# EAGLE design PinscapePico KL25Z Adapter - 74HC165 vsn (EAGLE 7.7.0)

## Sheet 1 of 6: Main
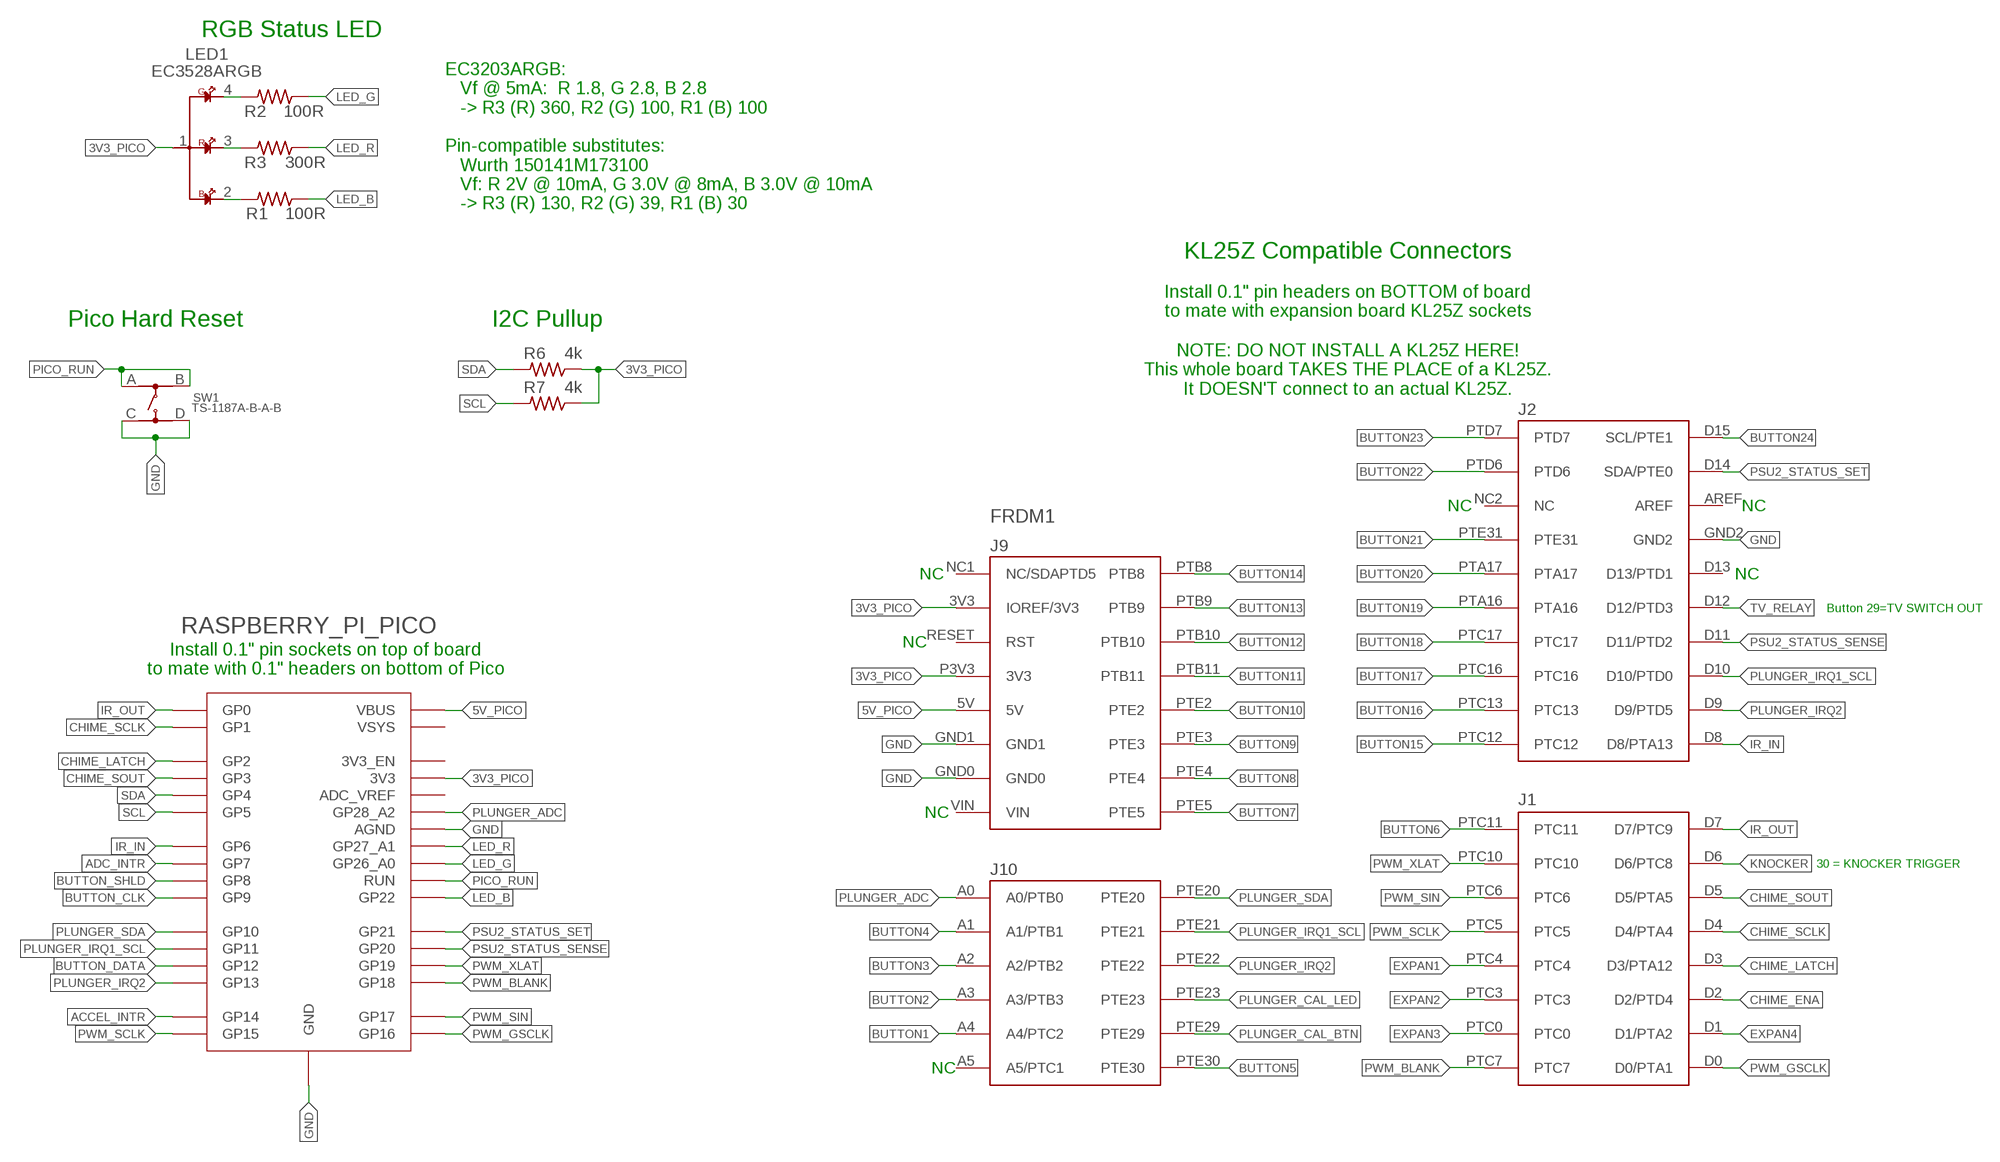
[diagram p0: schematic, sheet 1]

### Parts
FRDM1  KL25Z  FRDM-KL25ZNORMAL  [FRDM_KL25Z_NORMAL]
LED1  EC3528ARGB  [EC3528ARGB]
R1  100R  R-US_R1206  [R1206]
R2  100R  R-US_R1206  [R1206]
R3  300R  R-US_R1206  [R1206]
R6  4k  R-US_R1206  [R1206]
R7  4k  R-US_R1206  [R1206]
RASPBERRY_PI_PICO  RPI_PICO_NO_DEBUG  [RPI_PICO_TH_NO_DEBUG]
SW1  TS-1187A-B-A-B  [TS-1187A-B-A-B]

### Nets
3V3_PICO: FRDM1.3V3(IOREF/3V3) FRDM1.P3V3(3V3) LED1.1 R6.1 R7.1 RASPBERRY_PI_PICO.3V3 ; also sheet 2,3,4,5
5V_PICO: FRDM1.5V RASPBERRY_PI_PICO.VBUS
ACCEL_INTR: RASPBERRY_PI_PICO.GP14 ; also sheet 4
ADC_INTR: RASPBERRY_PI_PICO.GP7 ; also sheet 5
BUTTON1: FRDM1.A4(A4/PTC2) ; also sheet 2
BUTTON2: FRDM1.A3(A3/PTB3) ; also sheet 2
BUTTON3: FRDM1.A2(A2/PTB2) ; also sheet 2
BUTTON4: FRDM1.A1(A1/PTB1) ; also sheet 2
BUTTON5: FRDM1.PTE30 ; also sheet 2
BUTTON6: FRDM1.PTC11 ; also sheet 2
BUTTON7: FRDM1.PTE5 ; also sheet 2
BUTTON8: FRDM1.PTE4 ; also sheet 2
BUTTON9: FRDM1.PTE3 ; also sheet 2
BUTTON10: FRDM1.PTE2 ; also sheet 2
BUTTON11: FRDM1.PTB11 ; also sheet 2
BUTTON12: FRDM1.PTB10 ; also sheet 2
BUTTON13: FRDM1.PTB9 ; also sheet 2
BUTTON14: FRDM1.PTB8 ; also sheet 2
BUTTON15: FRDM1.PTC12 ; also sheet 2
BUTTON16: FRDM1.PTC13 ; also sheet 2
BUTTON17: FRDM1.PTC16 ; also sheet 2
BUTTON18: FRDM1.PTC17 ; also sheet 2
BUTTON19: FRDM1.PTA16 ; also sheet 2
BUTTON20: FRDM1.PTA17 ; also sheet 2
BUTTON21: FRDM1.PTE31 ; also sheet 2
BUTTON22: FRDM1.PTD6 ; also sheet 2
BUTTON23: FRDM1.PTD7 ; also sheet 2
BUTTON24: FRDM1.D15(SCL/PTE1) ; also sheet 2
BUTTON_CLK: RASPBERRY_PI_PICO.GP9 ; also sheet 2
BUTTON_DATA: RASPBERRY_PI_PICO.GP12 ; also sheet 2
BUTTON_SHLD: RASPBERRY_PI_PICO.GP8 ; also sheet 2
CHIME_ENA: FRDM1.D2(D2/PTD4) ; also sheet 3
CHIME_LATCH: FRDM1.D3(D3/PTA12) RASPBERRY_PI_PICO.GP2
CHIME_SCLK: FRDM1.D4(D4/PTA4) RASPBERRY_PI_PICO.GP1
CHIME_SOUT: FRDM1.D5(D5/PTA5) RASPBERRY_PI_PICO.GP3
EXPAN1: FRDM1.PTC4 ; also sheet 3
EXPAN2: FRDM1.PTC3 ; also sheet 3
EXPAN3: FRDM1.PTC0 ; also sheet 3
EXPAN4: FRDM1.D1(D1/PTA2) ; also sheet 3
GND: FRDM1.GND0 FRDM1.GND1 FRDM1.GND2 RASPBERRY_PI_PICO.AGND RASPBERRY_PI_PICO.GND@1(GND) RASPBERRY_PI_PICO.GND@2(GND) RASPBERRY_PI_PICO.GND@3(GND) RASPBERRY_PI_PICO.GND@4(GND) RASPBERRY_PI_PICO.GND@6(GND) RASPBERRY_PI_PICO.GND@7(GND) RASPBERRY_PI_PICO.GND@8(GND) SW1.C SW1.D ; also sheet 2,3,4,5
IR_IN: FRDM1.D8(D8/PTA13) RASPBERRY_PI_PICO.GP6
IR_OUT: FRDM1.D7(D7/PTC9) RASPBERRY_PI_PICO.GP0
KNOCKER: FRDM1.D6(D6/PTC8) ; also sheet 3
LED_B: R1.1 RASPBERRY_PI_PICO.GP22
LED_G: R2.1 RASPBERRY_PI_PICO.GP26_A0
LED_R: R3.1 RASPBERRY_PI_PICO.GP27_A1
N$8: LED1.3 R3.2
N$10: LED1.2 R1.2
N$13: LED1.4 R2.2
PICO_RUN: RASPBERRY_PI_PICO.RUN SW1.A SW1.B
PLUNGER_ADC: FRDM1.A0(A0/PTB0) RASPBERRY_PI_PICO.GP28_A2 ; also sheet 5
PLUNGER_CAL_BTN: FRDM1.PTE29 ; also sheet 3
PLUNGER_CAL_LED: FRDM1.PTE23 ; also sheet 3
PLUNGER_IRQ1_SCL: FRDM1.D10(D10/PTD0) FRDM1.PTE21 RASPBERRY_PI_PICO.GP11
PLUNGER_IRQ2: FRDM1.D9(D9/PTD5) FRDM1.PTE22 RASPBERRY_PI_PICO.GP13
PLUNGER_SDA: FRDM1.PTE20 RASPBERRY_PI_PICO.GP10
PSU2_STATUS_SENSE: FRDM1.D11(D11/PTD2) RASPBERRY_PI_PICO.GP20
PSU2_STATUS_SET: FRDM1.D14(SDA/PTE0) RASPBERRY_PI_PICO.GP21
PWM_BLANK: FRDM1.PTC7 RASPBERRY_PI_PICO.GP18
PWM_GSCLK: FRDM1.D0(D0/PTA1) RASPBERRY_PI_PICO.GP16
PWM_SCLK: FRDM1.PTC5 RASPBERRY_PI_PICO.GP15
PWM_SIN: FRDM1.PTC6 RASPBERRY_PI_PICO.GP17
PWM_XLAT: FRDM1.PTC10 RASPBERRY_PI_PICO.GP19
SCL: R7.2 RASPBERRY_PI_PICO.GP5 ; also sheet 3,4,5
SDA: R6.2 RASPBERRY_PI_PICO.GP4 ; also sheet 3,4,5
TV_RELAY: FRDM1.D12(D12/PTD3) ; also sheet 3
Unconnected: FRDM1.A5(A5/PTC1) FRDM1.AREF FRDM1.D13(D13/PTD1) FRDM1.NC1(NC/SDAPTD5) FRDM1.NC2(NC) FRDM1.RESET(RST) FRDM1.VIN RASPBERRY_PI_PICO.3V3_EN RASPBERRY_PI_PICO.ADC_VREF RASPBERRY_PI_PICO.VSYS

### Notes on the sheet
- RGB Status LED
- EC3203ARGB:
     Vf @ 5mA:  R 1.8, G 2.8, B 2.8
     -> R3 (R) 360, R2 (G) 100, R1 (B) 100
  
  Pin-compatible substitutes:
     Wurth 150141M173100
     Vf: R 2V @ 10mA, G 3.0V @ 8mA, B 3.0V @ 10mA
     -> R3 (R) 130, R2 (G) 39, R1 (B) 30
- KL25Z Compatible Connectors
- Install 0.1" pin headers on BOTTOM of board
  to mate with expansion board KL25Z sockets
- Pico Hard Reset | I2C Pullup
- NOTE: DO NOT INSTALL A KL25Z HERE!
  This whole board TAKES THE PLACE of a KL25Z.
  It DOESN'T connect to an actual KL25Z.
- NC | NC
- NC | NC
- Button 29=TV SWITCH OUT
- NC
- Install 0.1" pin sockets on top of board
  to mate with 0.1" headers on bottom of Pico
- NC
- 30 = KNOCKER TRIGGER
- NC

## Sheet 2 of 6: Buttons
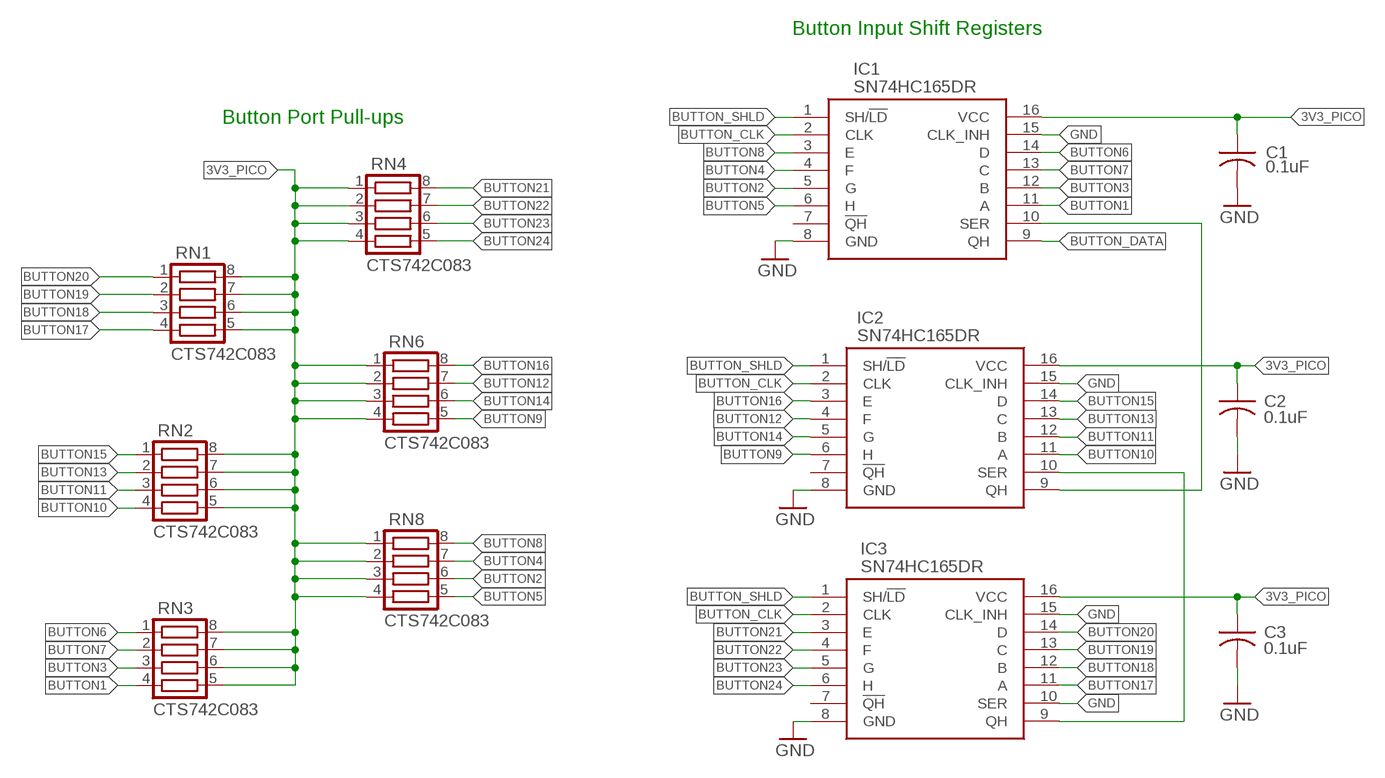
[diagram p1: schematic, sheet 2]

### Parts
C1  0.1uF  C-USC1206  [C1206]
C2  0.1uF  C-USC1206  [C1206]
C3  0.1uF  C-USC1206  [C1206]
IC1  SN74HC165DR  [SOIC127P600X175-16N]
IC2  SN74HC165DR  [SOIC127P600X175-16N]
IC3  SN74HC165DR  [SOIC127P600X175-16N]
RN1  CTS742C083  [CTS742C083]
RN2  CTS742C083  [CTS742C083]
RN3  CTS742C083  [CTS742C083]
RN4  CTS742C083  [CTS742C083]
RN6  CTS742C083  [CTS742C083]
RN8  CTS742C083  [CTS742C083]

### Nets
3V3_PICO: C1.1 C2.1 C3.1 IC1.16(VCC) IC2.16(VCC) IC3.16(VCC) RN1.5 RN1.6 RN1.7 RN1.8 RN2.5 RN2.6 RN2.7 RN2.8 RN3.5 RN3.6 RN3.7 RN3.8 RN4.1 RN4.2 RN4.3 RN4.4 RN6.1 RN6.2 RN6.3 RN6.4 RN8.1 RN8.2 RN8.3 RN8.4 ; also sheet 1,3,4,5
BUTTON1: IC1.11(A) RN3.4 ; also sheet 1
BUTTON2: IC1.5(G) RN8.6 ; also sheet 1
BUTTON3: IC1.12(B) RN3.3 ; also sheet 1
BUTTON4: IC1.4(F) RN8.7 ; also sheet 1
BUTTON5: IC1.6(H) RN8.5 ; also sheet 1
BUTTON6: IC1.14(D) RN3.1 ; also sheet 1
BUTTON7: IC1.13(C) RN3.2 ; also sheet 1
BUTTON8: IC1.3(E) RN8.8 ; also sheet 1
BUTTON9: IC2.6(H) RN6.5 ; also sheet 1
BUTTON10: IC2.11(A) RN2.4 ; also sheet 1
BUTTON11: IC2.12(B) RN2.3 ; also sheet 1
BUTTON12: IC2.4(F) RN6.7 ; also sheet 1
BUTTON13: IC2.13(C) RN2.2 ; also sheet 1
BUTTON14: IC2.5(G) RN6.6 ; also sheet 1
BUTTON15: IC2.14(D) RN2.1 ; also sheet 1
BUTTON16: IC2.3(E) RN6.8 ; also sheet 1
BUTTON17: IC3.11(A) RN1.4 ; also sheet 1
BUTTON18: IC3.12(B) RN1.3 ; also sheet 1
BUTTON19: IC3.13(C) RN1.2 ; also sheet 1
BUTTON20: IC3.14(D) RN1.1 ; also sheet 1
BUTTON21: IC3.3(E) RN4.8 ; also sheet 1
BUTTON22: IC3.4(F) RN4.7 ; also sheet 1
BUTTON23: IC3.5(G) RN4.6 ; also sheet 1
BUTTON24: IC3.6(H) RN4.5 ; also sheet 1
BUTTON_CLK: IC1.2(CLK) IC2.2(CLK) IC3.2(CLK) ; also sheet 1
BUTTON_DATA: IC1.9(QH) ; also sheet 1
BUTTON_SHLD: IC1.1(SH/!LD) IC2.1(SH/!LD) IC3.1(SH/!LD) ; also sheet 1
GND: C1.2 C2.2 C3.2 IC1.8(GND) IC1.15(CLK_INH) IC2.8(GND) IC2.15(CLK_INH) IC3.8(GND) IC3.10(SER) IC3.15(CLK_INH) ; also sheet 1,3,4,5
N$3: IC1.10(SER) IC2.9(QH)
N$4: IC2.10(SER) IC3.9(QH)
Unconnected: IC1.7(!QH) IC2.7(!QH) IC3.7(!QH)

### Notes on the sheet
- Button Input Shift Registers
- Button Port Pull-ups

## Sheet 3 of 6: GPIO Expander
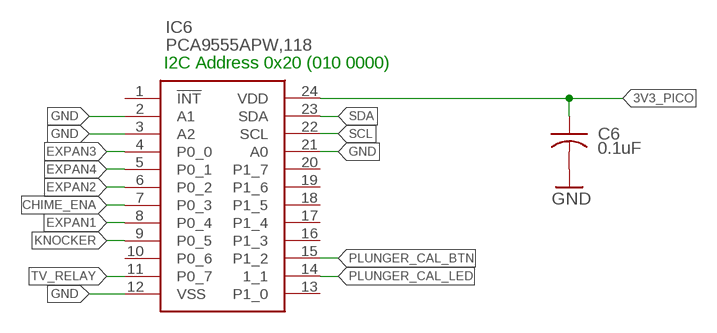
[diagram p2: schematic, sheet 3]

### Parts
C6  0.1uF  C-USC1206  [C1206]
IC6  PCA9555APW,118  [SOP65P640X110-24N]

### Nets
3V3_PICO: C6.1 IC6.24(VDD) ; also sheet 1,2,4,5
CHIME_ENA: IC6.7(P0_3) ; also sheet 1
EXPAN1: IC6.8(P0_4) ; also sheet 1
EXPAN2: IC6.6(P0_2) ; also sheet 1
EXPAN3: IC6.4(P0_0) ; also sheet 1
EXPAN4: IC6.5(P0_1) ; also sheet 1
GND: C6.2 IC6.2(A1) IC6.3(A2) IC6.12(VSS) IC6.21(A0) ; also sheet 1,2,4,5
KNOCKER: IC6.9(P0_5) ; also sheet 1
PLUNGER_CAL_BTN: IC6.15(P1_2) ; also sheet 1
PLUNGER_CAL_LED: IC6.14(1_1) ; also sheet 1
SCL: IC6.22(SCL) ; also sheet 1,4,5
SDA: IC6.23(SDA) ; also sheet 1,4,5
TV_RELAY: IC6.11(P0_7) ; also sheet 1
Unconnected: IC6.1(!INT) IC6.10(P0_6) IC6.13(P1_0) IC6.16(P1_3) IC6.17(P1_4) IC6.18(P1_5) IC6.19(P1_6) IC6.20(P1_7)

### Notes on the sheet
- I2C Address 0x20 (010 0000)

## Sheet 4 of 6: Accelerometer
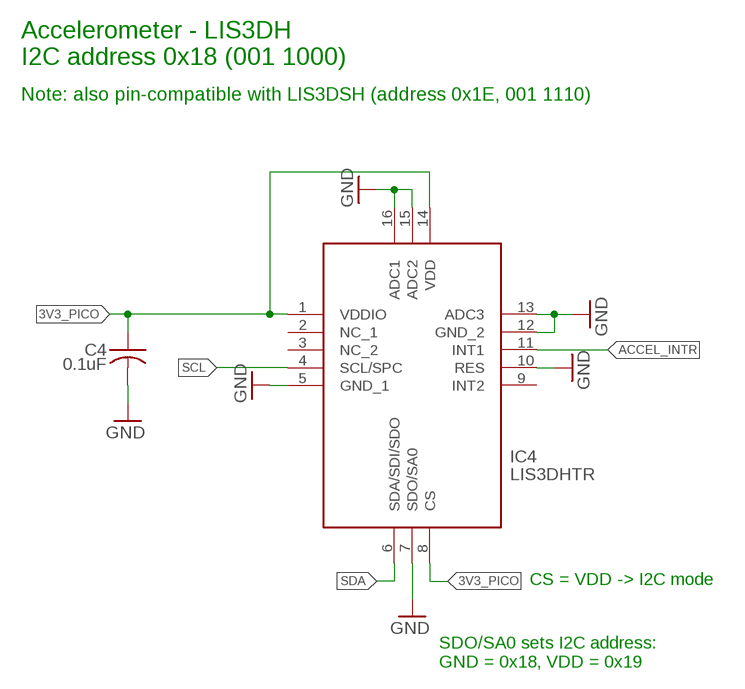
[diagram p3: schematic, sheet 4]

### Parts
C4  0.1uF  C-USC1206  [C1206]
IC4  LIS3DHTR  [LIS3DHTR]

### Nets
3V3_PICO: C4.1 IC4.1(VDDIO) IC4.8(CS) IC4.14(VDD) ; also sheet 1,2,3,5
ACCEL_INTR: IC4.11(INT1) ; also sheet 1
GND: C4.2 IC4.5(GND_1) IC4.7(SDO/SA0) IC4.10(RES) IC4.12(GND_2) IC4.13(ADC3) IC4.15(ADC2) IC4.16(ADC1) ; also sheet 1,2,3,5
SCL: IC4.4(SCL/SPC) ; also sheet 1,3,5
SDA: IC4.6(SDA/SDI/SDO) ; also sheet 1,3,5
Unconnected: IC4.2(NC_1) IC4.3(NC_2) IC4.9(INT2)

### Notes on the sheet
- Accelerometer - LIS3DH
  I2C address 0x18 (001 1000)
- Note: also pin-compatible with LIS3DSH (address 0x1E, 001 1110)
- CS = VDD -> I2C mode
- SDO/SA0 sets I2C address:
  GND = 0x18, VDD = 0x19

## Sheet 5 of 6: ADC
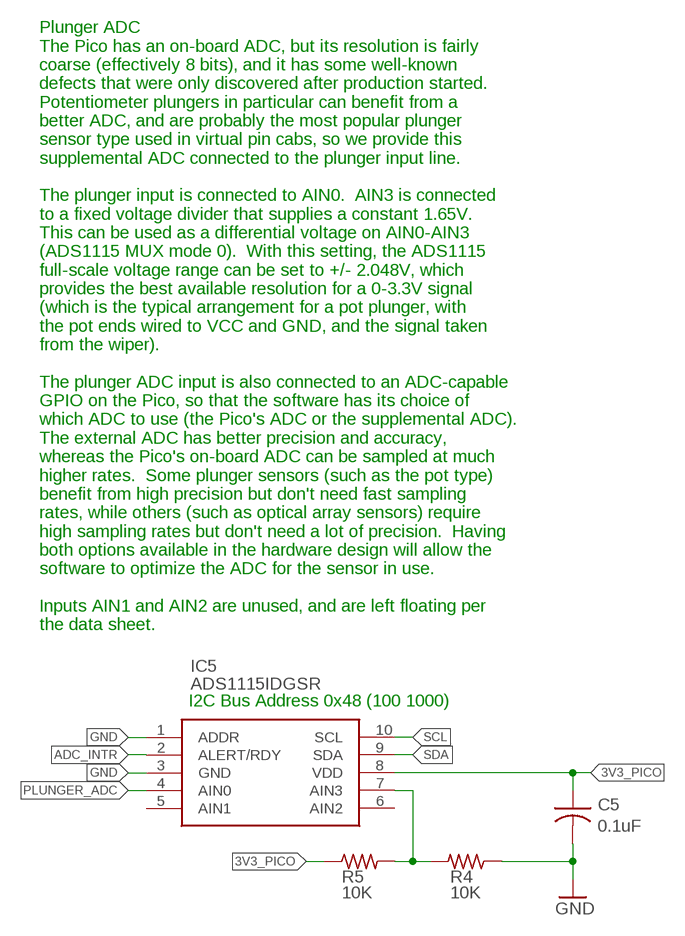
[diagram p4: schematic, sheet 5]

### Parts
C5  0.1uF  C-USC1206  [C1206]
IC5  ADS1115IDGSR  [SOP50P490X110-10N]
R4  10K  R-US_R1206  [R1206]
R5  10K  R-US_R1206  [R1206]

### Nets
3V3_PICO: C5.1 IC5.8(VDD) R5.1 ; also sheet 1,2,3,4
ADC_INTR: IC5.2(ALERT/RDY) ; also sheet 1
GND: C5.2 IC5.1(ADDR) IC5.3(GND) R4.1 ; also sheet 1,2,3,4
N$71: IC5.7(AIN3) R4.2 R5.2
PLUNGER_ADC: IC5.4(AIN0) ; also sheet 1
SCL: IC5.10(SCL) ; also sheet 1,3,4
SDA: IC5.9(SDA) ; also sheet 1,3,4
Unconnected: IC5.5(AIN1) IC5.6(AIN2)

### Notes on the sheet
- Plunger ADC
  The Pico has an on-board ADC, but its resolution is fairly
  coarse (effectively 8 bits), and it has some well-known
  defects that were only discovered after production started.
  Potentiometer plungers in particular can benefit from a
  better ADC, and are probably the most popular plunger
  sensor type used in virtual pin cabs, so we provide this
  supplemental ADC connected to the plunger input line.
  
  The plunger input is connected to AIN0.  AIN3 is connected
  to a fixed voltage divider that supplies a constant 1.65V.
  This can be used as a differential voltage on AIN0-AIN3
  (ADS1115 MUX mode 0).  With this setting, the ADS1115
  full-scale voltage range can be set to +/- 2.048V, which
  provides the best available resolution for a 0-3.3V signal
  (which is the typical arrangement for a pot plunger, with
  the pot ends wired to VCC and GND, and the signal taken
  from the wiper).
  
  The plunger ADC input is also connected to an ADC-capable
  GPIO on the Pico, so that the software has its choice of
  which ADC to use (the Pico's ADC or the supplemental ADC).
  The external ADC has better precision and accuracy,
  whereas the Pico's on-board ADC can be sampled at much
  higher rates.  Some plunger sensors (such as the pot type)
  benefit from high precision but don't need fast sampling
  rates, while others (such as optical array sensors) require
  high sampling rates but don't need a lot of precision.  Having
  both options available in the hardware design will allow the
  software to optimize the ADC for the sensor in use.
  
  Inputs AIN1 and AIN2 are unused, and are left floating per
  the data sheet.
- I2C Bus Address 0x48 (100 1000)

## Sheet 6 of 6: Notes
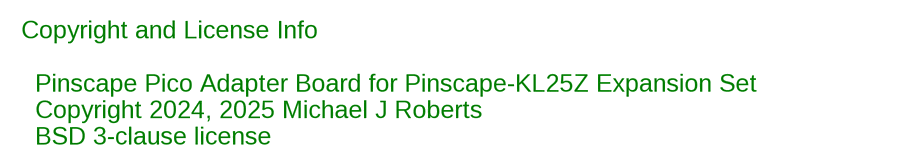
[diagram p5: schematic, sheet 6]

### Notes on the sheet
- Copyright and License Info
  
    Pinscape Pico Adapter Board for Pinscape-KL25Z Expansion Set
    Copyright 2024, 2025 Michael J Roberts
    BSD 3-clause license

## Library data of the parts
C1-C6 = rcl:C-US: CAPACITOR, American symbol; SPICEPREFIX: C
FRDM1 = kl25z:FRDM-KL25Z: For creating FRDM-KL25Z shields
IC1-IC3 = SamacSys_Parts:SN74HC165DR: 8-Bit Parallel-Load Shift Registers Source: Datasheet <http://www.ti.com/lit/ds/symlink/sn74hc165.pdf>; DESCRIPTION: 8-Bit Parallel-Load Shift Registers; HEIGHT: 1.75mm; MANUFACTURER_NAME: Texas Instruments; MANUFACTURER_PART_NUMBER: SN74HC165DR; MOUSER_PART_NUMBER: 595-SN74HC165DR; MOUSER_PRICE-STOCK: https://www.mouser.co.uk/ProductDetail/Texas-Instruments/SN74HC165DR?qs=vxEfx8VrU7AaZtng63yj8Q%3D%3D
IC4 = SamacSys_Parts:LIS3DHTR: Accelerometer 3-Axis 2g/16g 1.8V LGA16 STMicroelectronics LIS3DHTR Accelerometer IC, 3-axis, I2C, SPI 1.71 3.6 V, 16-Pin LGA Source: Datasheet <http://www.st.com/content/ccc/resource/technical/document/datasheet/3c/ae/50/85/d6/b1/46/fe/CD00274221.pdf/files/CD00274221.pdf/jcr:content/translations/en.CD00274221.pdf>; DESCRIPTION: Accelerometer 3-Axis 2g/16g 1.8V LGA16 STMicroelectronics LIS3DHTR Accelerometer IC, 3-axis, I2C, SPI 1.71 3.6 V, 16-Pin LGA; HEIGHT: 1mm; MANUFACTURER_NAME: STMicroelectronics; MANUFACTURER_PART_NUMBER: LIS3DHTR; MOUSER_PART_NUMBER: 511-LIS3DHTR; MOUSER_PRICE-STOCK: https://www.mouser.co.uk/ProductDetail/STMicroelectronics/LIS3DHTR?qs=6la6oa3D8xzhXYax3cEo4w%3D%3D
IC5 = SamacSys_Parts:ADS1115IDGSR: 16-Bit 860SPS 4-Ch Delta-Sigma ADC With PGA, Oscillator, Vref, Comparator, and I2C Source: Datasheet <http://www.ti.com/lit/gpn/ADS1115>; DESCRIPTION: 16-Bit 860SPS 4-Ch Delta-Sigma ADC With PGA, Oscillator, Vref, Comparator, and I2C; HEIGHT: 1.1mm; MANUFACTURER_NAME: Texas Instruments; MANUFACTURER_PART_NUMBER: ADS1115IDGSR; MOUSER_PART_NUMBER: 595-ADS1115IDGSR; MOUSER_PRICE-STOCK: https://www.mouser.co.uk/ProductDetail/Texas-Instruments/ADS1115IDGSR?qs=IK5e5L0zOXjKCJoVMhYO%2FQ%3D%3D
IC6 = SamacSys_Parts:PCA9555APW,118: NXP - PCA9555APW,118 - I/O EXPANDER, 16BIT, 400KHZ, TSSOP-24 Source: Datasheet <http://www.nxp.com/docs/en/data-sheet/PCA9555A.pdf>; DESCRIPTION: NXP - PCA9555APW,118 - I/O EXPANDER, 16BIT, 400KHZ, TSSOP-24; HEIGHT: 1.1mm; MANUFACTURER_NAME: NXP; MANUFACTURER_PART_NUMBER: PCA9555APW,118; MOUSER_PART_NUMBER: 771-PCA9555APW118; MOUSER_PRICE-STOCK: https://www.mouser.co.uk/ProductDetail/NXP-Semiconductors/PCA9555APW118?qs=5C9Q4QJFsuPmpoGpn%2FKoIQ%3D%3D
LED1 = SamacSys_Parts:EC3528ARGB: EC3528ARGB RGB LED, 5mA, common anode, SMD 3528 package; Dongguan Ousike Optoelectronics Technology Co., Ltd.
R1-R7 = resistor:R-US_: RESISTOR, American symbol
RASPBERRY_PI_PICO = RaspberryPi_Pico:RPI_PICO_NO_DEBUG
RN1-RN4 RN6 RN8 = resistor-net:CTS742C083: Chip Resistor Array 4 Single Resistor Source: http://www.ctscorp.com/components/Datasheets/CTSChipArrayDs.pdf; OC_FARNELL: unknown; OC_NEWARK: unknown
SW1 = SamacSys_Parts:TS-1187A-B-A-B

## Board
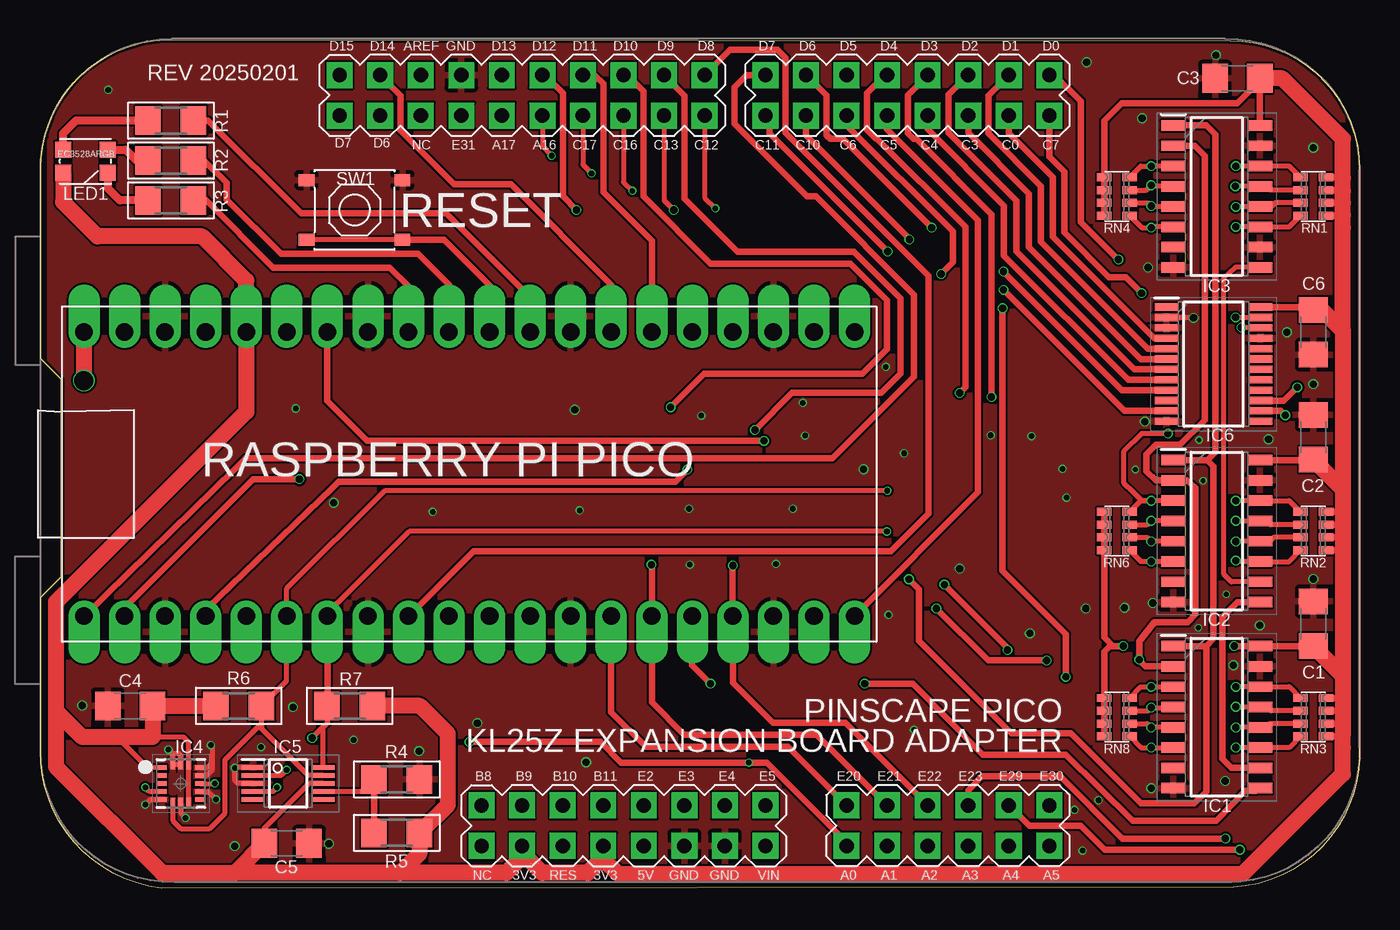
[diagram p6: board, top side]
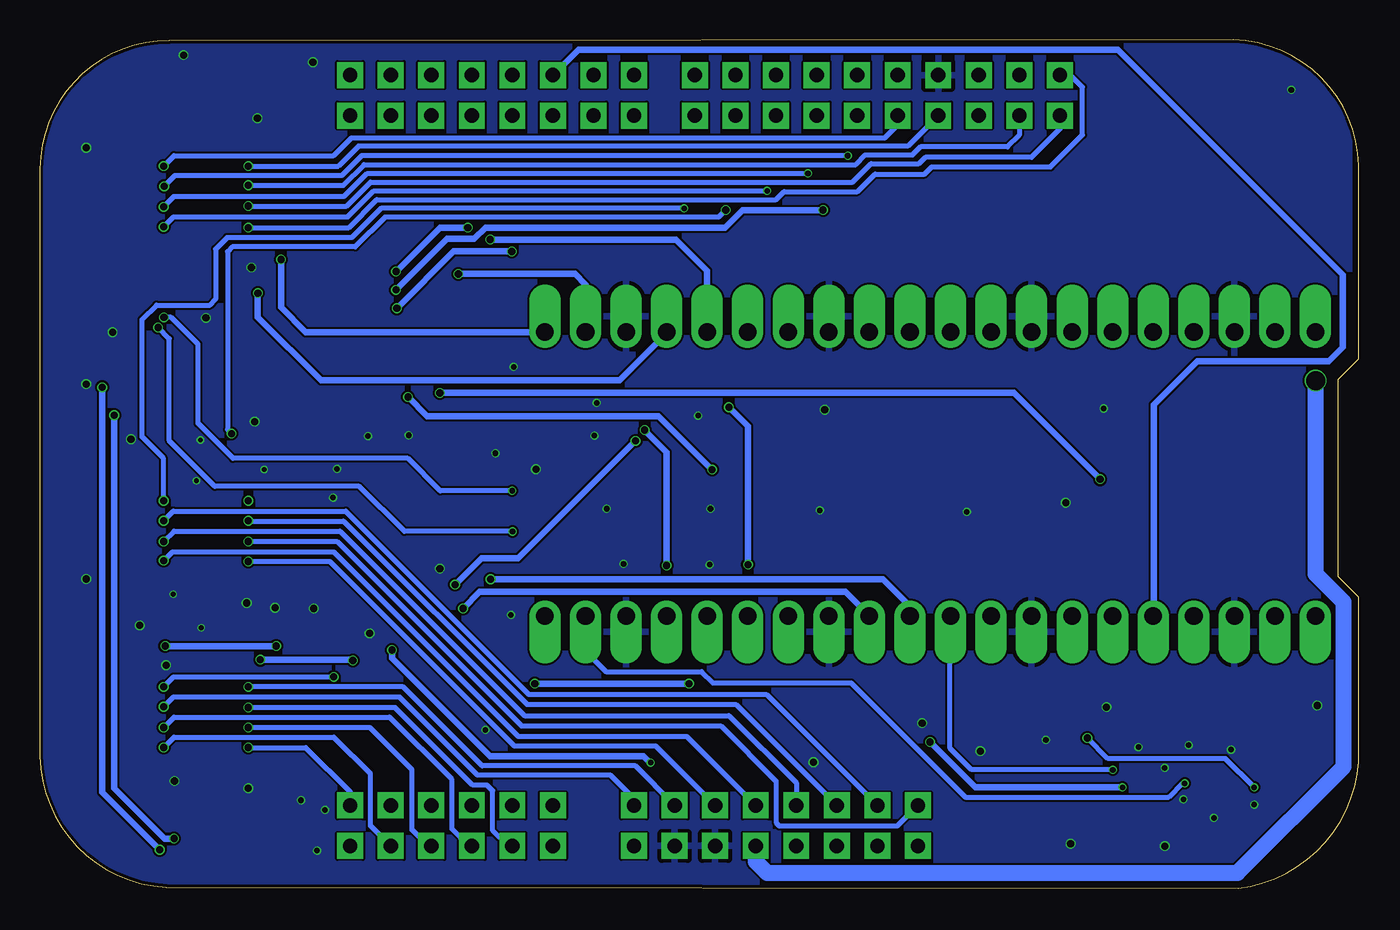
[diagram p7: board, bottom side, seen from below]

Size 82.6 x 53.1 mm. Coordinates in mm from the lower left corner, seen from the top.
Outline: 7.85,53.1 74.5,53.05 arc-90 82.6,45.05 82.6,8.25 arc-86 74.7,0.05 7.55,0 arc-79 0,7.9 0,18.2 1.3,19.5 1.3,31.85 0,33.15 0,45.25 arc-87 7.85,53.1
Copper layers (1*16): Top 0.035mm / dielectric 1.6mm / Bottom 0.035mm
Design rules "jlcpcb-2layers *": minimum track width 5mil, minimum drill 0.3mm, track to track 5mil, track to pad 5mil, pad to pad 5mil, via to via 5mil, smd to smd 5mil, copper to edge 0.2mm, drill to drill 6mil, minimum pad ring 10mil, minimum via ring 3mil, stop-mask expansion 4mil, vias tented up to drill 0mil, thermal gap 10mil

### Footprints (pad centres in the part's own frame; a part is rotated, then mirrored left to right if it is on the bottom)
C1206 = smd 1.6 x 1.8: 1 -1.4,0; 2 1.4,0
FRDM_KL25Z_NORMAL = drill 0.9 square: 3V3 24.13,-15.24; 5V 24.13,-7.62; A0 24.13,5.08; A1 24.13,7.62; A2 24.13,10.16; A3 24.13,12.7; A4 24.13,15.24; A5 24.13,17.78; AREF -24.13,-21.59; D0 -24.13,17.78; D1 -24.13,15.24; D2 -24.13,12.7; D3 -24.13,10.16; D4 -24.13,7.62; D5 -24.13,5.08; D6 -24.13,2.54; D7 -24.13,0; D8 -24.13,-3.81; D9 -24.13,-6.35; D10 -24.13,-8.89; D11 -24.13,-11.43; D12 -24.13,-13.97; D13 -24.13,-16.51; D14 -24.13,-24.13; D15 -24.13,-26.67; GND0 24.13,-2.54; GND1 24.13,-5.08; GND2 -24.13,-19.05; NC1 24.13,-17.78; NC2 -21.59,-21.59; P3V3 24.13,-10.16; PTA16 -21.59,-13.97; PTA17 -21.59,-16.51; PTB8 21.59,-17.78; PTB9 21.59,-15.24; PTB10 21.59,-12.7; PTB11 21.59,-10.16; PTC0 -21.59,15.24; PTC3 -21.59,12.7; PTC4 -21.59,10.16; PTC5 -21.59,7.62; PTC6 -21.59,5.08; PTC7 -21.59,17.78; PTC10 -21.59,2.54; PTC11 -21.59,0; PTC12 -21.59,-3.81; PTC13 -21.59,-6.35; PTC16 -21.59,-8.89; PTC17 -21.59,-11.43; PTD6 -21.59,-24.13; PTD7 -21.59,-26.67; PTE2 21.59,-7.62; PTE3 21.59,-5.08; PTE4 21.59,-2.54; PTE5 21.59,0; PTE20 21.59,5.08; PTE21 21.59,7.62; PTE22 21.59,10.16; PTE23 21.59,12.7; PTE29 21.59,15.24; PTE30 21.59,17.78; PTE31 -21.59,-19.05; RESET 24.13,-12.7; VIN 24.13,0
SOIC127P600X175-16N = smd 1.525 x 0.65: 1 -2.712,4.445; 2 -2.712,3.175; 3 -2.712,1.905; 4 -2.712,0.635; 5 -2.712,-0.635; 6 -2.712,-1.905; 7 -2.712,-3.175; 8 -2.712,-4.445; 9 2.712,-4.445; 10 2.712,-3.175; 11 2.712,-1.905; 12 2.712,-0.635; 13 2.712,0.635; 14 2.712,1.905; 15 2.712,3.175; 16 2.712,4.445
LIS3DHTR = smd 0.6 x 0.3: 1 -1.2,1; 2 -1.2,0.5; 3 -1.2,0; 4 -1.2,-0.5; 5 -1.2,-1; 9 1.2,-1; 10 1.2,-0.5; 11 1.2,0; 12 1.2,0.5; 13 1.2,1 | smd 0.3 x 0.6: 6 -0.5,-1.2; 7 0,-1.2; 8 0.5,-1.2; 14 0.5,1.2; 15 0,1.2; 16 -0.5,1.2
SOP50P490X110-10N = smd 1.4 x 0.3: 1 -2.2,1; 2 -2.2,0.5; 3 -2.2,0; 4 -2.2,-0.5; 5 -2.2,-1; 6 2.2,-1; 7 2.2,-0.5; 8 2.2,0; 9 2.2,0.5; 10 2.2,1
SOP65P640X110-24N = smd 1.475 x 0.45: 1 -2.938,3.575; 2 -2.938,2.925; 3 -2.938,2.275; 4 -2.938,1.625; 5 -2.938,0.975; 6 -2.938,0.325; 7 -2.938,-0.325; 8 -2.938,-0.975; 9 -2.938,-1.625; 10 -2.938,-2.275; 11 -2.938,-2.925; 12 -2.938,-3.575; 13 2.938,-3.575; 14 2.938,-2.925; 15 2.938,-2.275; 16 2.938,-1.625; 17 2.938,-0.975; 18 2.938,-0.325; 19 2.938,0.325; 20 2.938,0.975; 21 2.938,1.625; 22 2.938,2.275; 23 2.938,2.925; 24 2.938,3.575
EC3528ARGB = smd 1 x 1: 1 -0.725,1.4; 2 0.725,1.4; 3 -0.725,-1.4; 4 0.725,-1.4
R1206 = smd 1.6 x 1.803: 1 -1.422,0; 2 1.422,0
RPI_PICO_TH_NO_DEBUG = drill 1.1 pad 1.6 offset: 3V3 8.89,13.97; 3V3_EN 8.89,16.51; ADC_VREF 8.89,11.43; AGND 8.89,6.35; GND@1 -8.89,19.05; GND@2 -8.89,6.35; GND@3 -8.89,-6.35; GND@4 -8.89,-19.05; GND@6 8.89,-19.05; GND@7 8.89,-6.35; GND@8 8.89,19.05; GP0 -8.89,24.13; GP1 -8.89,21.59; GP2 -8.89,16.51; GP3 -8.89,13.97; GP4 -8.89,11.43; GP5 -8.89,8.89; GP6 -8.89,3.81; GP7 -8.89,1.27; GP8 -8.89,-1.27; GP9 -8.89,-3.81; GP10 -8.89,-8.89; GP11 -8.89,-11.43; GP12 -8.89,-13.97; GP13 -8.89,-16.51; GP14 -8.89,-21.59; GP15 -8.89,-24.13; GP16 8.89,-24.13; GP17 8.89,-21.59; GP18 8.89,-16.51; GP19 8.89,-13.97; GP20 8.89,-11.43; GP21 8.89,-8.89; GP22 8.89,-3.81; GP26_A0 8.89,1.27; GP27_A1 8.89,3.81; GP28_A2 8.89,8.89; RUN 8.89,-1.27; VBUS 8.89,24.13; VSYS 8.89,21.59
CTS742C083 = smd 0.5 x 0.9: 1 -1.2,-0.8; 2 -0.4,-0.8; 3 0.4,-0.8; 4 1.2,-0.8; 5 1.2,0.8; 6 0.4,0.8; 7 -0.4,0.8; 8 -1.2,0.8
TS-1187A-B-A-B = smd 1 x 0.75: A -3,1.875; B 3,1.875; C -3,-1.875; D 3,-1.875

### Placement (x,y rotation side)
C1  79.7,16.55 90 top
C2  79.7,28.22 90 top
C3  74.95,50.7 180 top
C4  5.6,11.4 180 top
C5  15.4,2.8 0 top
C6  79.7,34.8 270 top
FRDM1  45.39,26.77 270 top
IC1  73.65,10.7 0 top
IC2  73.65,22.35 0 top
IC3  73.65,43.3 0 top
IC4  8.78,6.54 0 top
IC5  15.5,6.55 0 top
IC6  73.45,32.8 0 top
LED1  2.8,45.5 90 top
R1  8.15,48.05 180 top
R2  8.15,45.55 180 top
R3  8.15,43.05 180 top
R4  22.3,6.8 180 top
R5  22.3,3.45 180 top
R6  12.4,11.4 0 top
R7  19.35,11.4 180 top
RASPBERRY_PI_PICO  26.84,25.92 90 top
RN1  79.7,43.3 270 top
RN2  79.7,22.35 270 top
RN3  79.7,10.7 270 top
RN4  67.4,43.3 270 top
RN6  67.4,22.35 270 top
RN8  67.4,10.7 270 top
SW1  19.65,42.45 180 top

### Tracks (layer width: path | path; a pad name or v marks a point on that pad's centre or on a via)
3V3_PICO  (via drill 0.45)
  Top 0.3: IC4.8 IC4.14 9.28,9.12 8.95,9.45 7,9.45 | C6.1 79.68,36.22 79.3,36.38 | IC5.8 16.8,6.55 14,3.75 C5.1 | 4.8,9.45 6.71,7.54 IC4.1
  Top 0.4: v74.75,15.15 v74.76,15.15 IC1.16 C1.1 | IC6.24 79.3,36.38 | 81.45,42.25 81.48,42.22 | 81.48,42.22 81.55,42.15 | 81.45,41.45 81.55,41.35 | 81.5,22.1 81.55,22.05 81.45,21.95 RN2.6 | 81.55,9.6 81.5,9.65 81.35,9.5 RN3.5 | RN8.4 RN8.3 RN8.2 RN8.1 66.6,14.8 66.95,15.15 v67.8,15.15 67.15,15.15 66.6,15.7 RN6.4 RN6.3 RN6.2 RN6.1 | RN4.4 RN4.3 RN4.2 RN4.1 66.6,48.05 67.7,49.15 74.96,49.15 76.35,50.54 C3.1 IC3.16 | IC2.16 79.68,26.8 C2.1 | RN2.8 81.55,23.55 | RN2.7 81.55,22.75 | RN2.5 81.45,21.15 81.55,21.25 | RN1.8 81.5,44.5 81.55,44.45 | RN1.7 81.5,43.7 81.55,43.65 | RN1.6 81.55,42.9 | RN1.5 81.35,42.1 81.48,42.22 | RN3.8 81.5,11.9 81.55,11.85 | RN3.7 81.5,11.1 81.55,11.05 | RN3.6 81.45,10.3 81.55,10.2
  Top 1: LED1.1 1.4,42.95 3.55,40.8 10.1,40.8 12.87,38.03 RASPBERRY_PI_PICO.3V3 12.87,29.82 0.95,17.9 0.95,11.1 | 81.55,34.9 81.55,25 | 81.55,25 81.55,23.55 81.55,22.75 81.55,22.05 81.55,21.25 81.55,13.3 | 81.55,34.9 81.55,41.35 81.55,42.15 81.55,42.9 81.55,43.65 81.55,44.45 81.55,46.9 77.75,50.7 C3.1 | 12.2,0.95 7.6,0.95 0.95,7.6 0.95,11.1 | 22.5,0.95 29.15,0.95 30.15,1.95 FRDM1.3V3 30.15,2.2 31.4,0.95 34.25,0.95 35.23,1.93 FRDM1.P3V3 35.23,1.82 36.15,0.9 75.3,0.9 81.55,7.15 81.55,8.8 81.55,9.6 81.55,10.2 81.55,11.05 81.55,11.85 81.55,13.3 | R6.1 C4.1 7,9.45 4.8,9.45 2.6,9.45 0.95,11.1 | C5.1 12.2,1 12.2,0.95 | C6.1 80.25,36.2 81.55,34.9 | 22.5,0.95 12.2,0.95 | 22.5,0.95 23.72,2.17 R5.1 25.5,5.23 25.5,9.65 23.75,11.4 R7.1 | C1.1 81.55,13.3 | C2.1 81.52,25 81.55,25
  Bottom 0.4: v74.75,15.15 v67.8,15.15
5V_PICO  (via drill 1.2)
  Top 1: v2.7,31.77 v2.71,31.78 RASPBERRY_PI_PICO.VBUS
  Bottom 1: FRDM1.5V 37.77,1.67 37.05,0.95 7.6,0.95 0.95,7.6 0.95,17.9 2.7,19.65 v2.7,31.77
ACCEL_INTR  (via drill 0.35)
  Top 0.3: IC4.11 10.79,6.54 v10.9,6.55
  Bottom 0.3: RASPBERRY_PI_PICO.GP14 48.43,14.83 47.15,13.55 41.15,13.55 40.45,12.85 31.8,12.85 24.65,5.7 11.9,5.7 11.05,6.55 v10.9,6.55
ADC_INTR  (via drill 0.35)
  Top 0.3: IC5.2 15.05,7.05 v15.4,7.4
  Bottom 0.3: v15.4,7.4 15.4,7.45 24.3,7.45 25.6,8.75 25.6,17 RASPBERRY_PI_PICO.GP7
BUTTON1  (via drill 0.45)
  Top 0.3: IC1.11 74.91,8.79 v74.85,8.8 | IC1.11 77.01,8.79 | RN3.4 78.2,8.79 IC1.11
  Bottom 0.3: v74.85,8.8 74.2,9.45 64.2,9.45 61.9,7.15 61.9,3.9 FRDM1.A4
BUTTON2  (via drill 0.45)
  Top 0.3: IC1.5 69.57,10.07 v69.55,10.05 69.3,10.3 RN8.6
  Bottom 0.3: FRDM1.A3 58.29,2.64 59.3,3.65 59.3,7.42 61.93,10.05 v69.55,10.05
BUTTON3  (via drill 0.45)
  Top 0.3: v74.85,10.05 74.87,10.07 IC1.12 76.75,10.07 76.98,10.3 RN3.3
  Bottom 0.3: FRDM1.A2 55.74,2.64 56.8,3.7 56.8,6.8 60.7,10.7 74.2,10.7 v74.85,10.05
BUTTON4  (via drill 0.45)
  Top 0.3: IC1.4 70.9,11.3 v69.55,11.3 69.35,11.1 RN8.7
  Bottom 0.3: FRDM1.A1 53.29,2.64 54.25,3.6 54.25,6.1 54.6,6.45 55.5,6.45 60.35,11.3 v69.55,11.3
BUTTON5  (via drill 0.45)
  Top 0.3: IC1.6 v69.55,8.8 v69.55,8.79 68.91,8.79 RN8.5
  Bottom 0.3: v69.55,8.8 65.95,8.8 63.17,6.02 FRDM1.PTE30
BUTTON6  (via drill 0.45)
  Top 0.3: v64.2,13.23 64.2,13.21 | IC1.14 v74.86,12.61 v74.85,12.6 | IC1.14 76.95,12.61 | IC1.14 78.2,12.61 RN3.1
  Top 0.4: v53.04,39.86 45.64,47.26 45.64,48.11 FRDM1.PTC11 | v60.24,36.3 60.24,19.86 64.2,15.9 v64.2,13.23
  Bottom 0.3: v74.85,12.6 74.23,13.23 v64.2,13.23
  Bottom 0.4: v53.04,39.86 56.69,39.86 v60.24,36.31 v60.24,36.3
BUTTON7  (via drill 0.45)
  Top 0.3: v74.85,11.35 74.87,11.34 IC1.13 76.82,11.34 77.05,11.1 RN3.2
  Bottom 0.3: FRDM1.PTE5 45.39,5.59 46.87,7.07 55.2,7.07 60.1,11.98 74.23,11.98 v74.85,11.35
BUTTON8  (via drill 0.45)
  Top 0.3: IC1.3 v69.56,12.61 v69.55,12.6 68.9,12.6 RN8.8
  Bottom 0.3: FRDM1.PTE4 42.85,5.2 45.3,7.65 54.9,7.65 59.85,12.6 v69.55,12.6
BUTTON9  (via drill 0.45)
  Top 0.3: IC2.6 v69.56,20.45 v69.55,20.45 68.9,20.45 RN6.5
  Bottom 0.3: v69.55,20.45 64.45,20.45 52.9,8.9 44.03,8.9 FRDM1.PTE3
BUTTON10  (via drill 0.45)
  Top 0.3: IC2.11 74.91,20.45 v74.85,20.5 | IC2.11 77.01,20.45 | IC2.11 78.2,20.45 RN2.4
  Bottom 0.3: v74.85,20.5 74.3,21.05 64.2,21.05 52.65,9.5 42.09,9.5 FRDM1.PTE2
BUTTON11  (via drill 0.45)
  Top 0.3: v74.85,21.7 74.87,21.71 IC2.12 76.98,21.71 77.22,21.95 RN2.3
  Bottom 0.3: v74.85,21.7 74.2,22.35 63.8,22.35 52.25,10.8 39.45,10.8 35.23,6.58 FRDM1.PTB11
BUTTON12  (via drill 0.45)
  Top 0.3: IC2.4 69.57,22.98 v69.55,23 69.3,22.75 RN6.7
  Bottom 0.3: v69.55,23 69.53,22.98 63.58,22.98 52.1,11.5 39.01,11.5 FRDM1.PTB10
BUTTON13  (via drill 0.45)
  Top 0.3: v74.85,23 76.35,23 IC2.13 76.77,22.98 77,22.75 RN2.2
  Bottom 0.3: v74.85,23 74.25,23.6 63.45,23.6 51.98,12.13 37.1,12.13 FRDM1.PTB9
BUTTON14  (via drill 0.45)
  Top 0.3: IC2.5 69.57,21.71 v69.55,21.7 69.3,21.95 RN6.6
  Bottom 0.3: v69.55,21.7 64,21.7 52.45,10.15 39.95,10.15 36.5,6.7 36.5,4.1 36.3,3.9 28.9,3.9 FRDM1.PTB8
BUTTON15  (via drill 0.35, 0.45)
  Top 0.3: FRDM1.PTC12 41.58,43.22 v42.25,42.55 | IC2.14 v74.86,24.25 v74.85,24.25 | IC2.14 77,24.25 | IC2.14 78.2,24.25 RN2.1
  Bottom 0.3: v42.25,42.55 61.25,42.55 63.07,40.72 70.88,40.72 71.6,40 71.6,36.85 71.95,36.5 75.3,36.5 76.2,35.6 76.2,28.25 74.85,26.9 v74.85,24.25
BUTTON16  (via drill 0.45)
  Top 0.3: FRDM1.PTC13 39.04,43.06 v39.65,42.45 | IC2.3 v69.56,24.25 | v69.56,24.25 68.96,24.25 68.14,25.07 68.13,25.07 67.85,25.35 67.85,27.35 68.95,28.45 v70.6,28.45 | v69.56,24.25 v69.55,24.25 68.9,24.25 RN6.8
  Bottom 0.3: v39.65,42.45 40.1,42 60.99,42 62.85,40.15 70.55,40.15 70.85,39.85 70.85,28.7 v70.6,28.45
BUTTON17  (via drill 0.35, 0.45)
  Top 0.3: IC3.11 v74.86,41.39 v74.85,41.4 | FRDM1.PTC16 36.5,44.2 v37.05,43.65 | IC3.11 77.01,41.39 | IC3.11 78.2,41.39 RN1.4
  Bottom 0.3: v74.85,41.4 74.25,42 63.35,42 61.7,43.65 v37.05,43.65
BUTTON18  (via drill 0.35, 0.45)
  Top 0.3: v74.85,42.65 74.98,42.66 IC3.12 76.41,42.61 77.04,42.61 77.32,42.9 RN1.3 | FRDM1.PTC17 33.96,45.29 v34.5,44.75
  Bottom 0.3: v74.85,42.65 74.2,43.3 63.55,43.3 62.1,44.75 v34.5,44.75
BUTTON19  (via drill 0.35, 0.45)
  Top 0.3: v74.82,43.93 IC3.13 76.77,43.93 77,43.7 RN1.2 | FRDM1.PTA16 31.42,46.43 v32,45.85
  Bottom 0.3: v74.82,43.93 74.15,44.6 63.7,44.6 62.45,45.85 v32,45.85
BUTTON20  (via drill 0.45)
  Top 0.3: IC3.14 v74.86,45.2 v74.85,45.2 | IC3.14 77,45.2 | RN1.1 78.2,45.2 IC3.14
  Bottom 0.3: v74.85,45.2 74.2,45.85 64.2,45.85 63.1,46.95 29.7,46.95 28.88,47.77 FRDM1.PTA17
BUTTON21  (via drill 0.45)
  Top 0.3: IC3.3 v69.56,45.2 v69.55,45.2 68.9,45.2 RN4.8
  Bottom 0.3: FRDM1.PTE31 28.25,46.45 62.65,46.45 63.9,45.2 v69.55,45.2
BUTTON22  (via drill 0.45)
  Top 0.3: IC3.4 69.62,43.93 v69.55,44 69.25,43.7 RN4.7
  Bottom 0.3: FRDM1.PTD6 21.26,47.14 22,46.4 27.45,46.4 27.95,45.9 30.9,45.9 31.5,45.3 62.3,45.3 63.6,44 v69.55,44
BUTTON23  (via drill 0.45)
  Top 0.3: IC3.5 69.59,42.66 v69.55,42.7 69.35,42.9 RN4.6
  Bottom 0.3: FRDM1.PTD7 18.72,47.53 20.5,45.75 27.15,45.75 27.55,45.35 30.55,45.35 31.7,44.2 61.9,44.2 63.4,42.7 v69.55,42.7
BUTTON24  (via drill 0.45)
  Top 0.3: IC3.6 69.59,41.39 v69.55,41.35 68.95,41.35 RN4.5
  Bottom 0.3: FRDM1.D15 18.05,50.9 17.3,50.15 17.3,47.15 19.3,45.15 26.75,45.15 27.2,44.7 30.3,44.7 31.4,43.6 36,43.6 36.5,43.1 61.5,43.1 63.25,41.35 v69.55,41.35
BUTTON_CLK  (via drill 0.45)
  Top 0.4: IC3.2 72.28,46.47 72.9,45.85 72.9,29.3 71.35,27.75 69.85,27.75 69.25,27.15 69.25,26.1 69.83,25.53 IC2.2 71.78,25.53 72.3,25.05 72.3,17.15 71.85,16.65 69.75,16.65 68.8,15.45 v68.8,14.3 68.8,14.25 69.18,13.88 IC1.2 | v63,14.25 59.35,14.25 v56.1,17.5
  Bottom 0.4: RASPBERRY_PI_PICO.GP9 30.65,17.05 32.15,18.55 55.05,18.55 v56.1,17.5 | v68.8,14.3 63.05,14.3 v63,14.25
BUTTON_DATA  (via drill 0.45)
  Top 0.4: RASPBERRY_PI_PICO.GP12 40.8,13.95 v41.95,12.8 | v51.6,12.8 54.61,12.8 59.01,8.35 64.2,8.35 68.4,4.2 73.6,4.2 73.65,4.25 75.45,6.1 76.1,6.1 76.26,6.25 IC1.9
  Bottom 0.4: v51.6,12.8 v41.95,12.8
BUTTON_SHLD  (via drill 0.45)
  Top 0.4: IC1.1 73,15.15 | 73,15.15 73.45,15.6 73.45,26.4 73.06,26.8 | IC2.1 73.06,26.8 | IC3.1 73.01,47.74 73.55,47.2 73.55,27.29 73.06,26.8 | 73,15.15 73,6.04 72.25,5.3 68.9,5.3 64.52,9.68 60.8,9.68 55,15.48 55,18.71 v54.38,19.34
  Bottom 0.4: RASPBERRY_PI_PICO.GP8 28.13,17.05 | v54.38,19.34 54.36,19.35 29.8,19.35 28.11,17.66 RASPBERRY_PI_PICO.GP8 | 28.11,17.36 RASPBERRY_PI_PICO.GP8
CHIME_ENA
  Top 0.4: FRDM1.D2 56.85,49.66 56.85,47.3 61.11,43.04 61.11,39.86 68.5,32.47 IC6.7
CHIME_LATCH  (via drill 0.45)
  Top 0.4: FRDM1.D3 54.3,49.65 54.3,47.25 54.65,46.9 54.85,46.9 59.55,42.2 v59.55,30.75 | RASPBERRY_PI_PICO.GP2 10.33,17.43 18.27,25.07 18.65,25.45 39.75,25.45 v40.5,26.2
  Bottom 0.4: 59.5,30.75 v59.55,30.75 58.35,29.55 43.85,29.55 v40.5,26.2
CHIME_SCLK  (via drill 0.45)
  Top 0.4: FRDM1.D4 52.9,50.9 51.75,49.75 51.75,47.49 52.29,46.95 52.35,46.95 57.9,41.4 57.9,31.35 v57.55,31 | v16.2,25.6 13.3,25.6 5.25,17.55 RASPBERRY_PI_PICO.GP1 5.25,17.15
  Bottom 0.4: v57.55,31 21.6,31 v16.2,25.6
CHIME_SOUT
  Bottom 0.4: FRDM1.D5 48.87,52.5 15.1,52.5 0.99,38.39 0.99,33.86 1.88,32.97 10.12,32.97 12.85,30.25 12.85,17.05 RASPBERRY_PI_PICO.GP3
EXPAN1
  Top 0.4: FRDM1.PTC4 55.55,47.5 60.34,42.71 60.34,39.59 68.11,31.82 IC6.8
EXPAN2
  Top 0.4: FRDM1.PTC3 58.09,47.28 61.89,43.48 61.89,40.13 68.9,33.12 IC6.6
EXPAN3
  Top 0.4: FRDM1.PTC0 60.63,47.26 63.38,44.51 63.38,40.78 69.74,34.42 IC6.4
EXPAN4
  Top 0.4: FRDM1.D1 59.35,49.62 59.35,47.25 62.65,43.95 62.65,40.46 69.34,33.77 IC6.5
GND  (via drill 0.3, 0.35, 0.45)
  Top 0.3: IC4.5 6.87,5.54 v6.55,5.22 | IC4.12 10.38,7.04 10.72,7.39 10.72,7.85 | v10.65,8.95 10.72,8.88 10.72,7.85 | IC4.7 8.78,4.7 v9.08,4.4 | IC4.10 10.48,6.04 v10.97,5.55 | IC6.2 72.18,35.72 v72.2,35.7 | IC5.3 12.35,6.55 12.15,6.75 v12.15,7.52 12.18,7.55 IC5.1 | IC4.13 10.42,7.54 10.72,7.85 | 8.23,8.45 8.28,8.4 IC4.16 IC4.15 8.78,8.28 8.6,8.45 8.23,8.45 | 8.23,8.45 v8,8.68
  other vias: 69.65,17.85 68.98,48.2 59.5,28.35 54.07,27.23 18.35,24.12 69.15,29.2 47.1,23.75 51.53,26.22 74.7,13.95 64.25,24.45 65.45,17.5 57.55,20 67.88,17.55 69.55,6.25 74.18,6.7 15.8,11.33 65.5,51.7 61.95,15.95 33.45,29.95 62.05,28.3 79.7,46.35 76.9,28.1 79.7,19.35 79.7,31.55 12.15,2.62 19.6,9.28 23.7,8.58 18.05,2.77 78.05,34.8 46.05,20.3 27.35,10.33 69.35,38.85 54.7,9.9 2.6,11.43 73.6,52.15 76.35,16.45 64,26.25 40.65,20.25 40.6,23.75 33.75,23.65 24.55,23.55 72.8,25.5 74.25,18.4 72.5,16.3 68.55,26.2 72.55,28.05 41.38,29.57 47.88,28.32 47.73,30.38 52.92,32.62 53.1,17.1 13.8,8.83 15.97,30.03 4.23,49.97 65.25,2.35 66.25,5.5 64.75,4.9 34.15,7.87
  pour Top: 0.6,53.5 82.3,53.5 82.3,0.2 0.6,0.2
  pour Bottom: 0.6,53.5 82.3,53.5 82.3,0.3 0.6,0.3
IR_IN
  Top 0.4: RASPBERRY_PI_PICO.GP6 27.1,21.1 53.25,21.1 55.6,23.45 55.6,38.35 46.65,47.3 46.65,52 46.15,52.5 43.18,52.5 FRDM1.D8
IR_OUT
  Top 0.4: RASPBERRY_PI_PICO.GP0 2.73,17.03 12.21,26.29 12.82,26.9 49.6,26.9 54.7,32 54.7,37.15 48.55,43.3 48,43.3 43.45,47.85 43.45,50.15 44.2,50.9 FRDM1.D7
KNOCKER  (via drill 0.45)
  Top 0.4: FRDM1.D6 49.2,49.63 49.2,47.15 49.45,46.9 50.25,46.9 v55.8,41.35 | v60.3,38.6 60.3,38.58 67.71,31.18 IC6.9
  Bottom 0.4: v60.3,38.6 57.55,41.35 v55.8,41.35
LED_B
  Top 0.4: R1.1 10.5,48.05 16.3,42.25 25.4,42.25 28.8,38.85
  Top 0.406: RASPBERRY_PI_PICO.GP22 30.65,37 28.8,38.85
LED_G
  Top 0.4: R2.1 10.25,45.55 11.65,44.15 11.65,43.1 15.05,39.7 23.65,39.7 25.57,37.78
  Top 0.406: RASPBERRY_PI_PICO.GP26_A0 25.57,37.78
LED_R
  Top 0.4: R3.1 10.35,43.05 14.55,38.85 21.85,38.85
  Top 0.406: RASPBERRY_PI_PICO.GP27_A1 23.03,37.67 21.85,38.85
N$3
  Top 0.4: IC1.10 74.58,7.52 74,8.1 74,16.95 74.96,17.91 IC2.9
N$4
  Top 0.3: IC2.10 74.58,19.18 74.1,19.65 74.1,38.2 74.81,38.85 IC3.9
N$8
  Top 0.5: LED1.3 4.2,43.8 4.95,43.05 R3.2
N$10
  Top 0.5: R1.2 2.2,48.05 1.4,47.25 LED1.2
N$13
  Top 0.5: LED1.4 5.33,46.22 6,45.55 R2.2
N$71
  Top 0.3: IC5.7 20.88,6.05
  Top 0.4: R4.2 20.88,6.05 R5.2
PICO_RUN
  Top 0.3: SW1.A SW1.B
  Top 0.4: RASPBERRY_PI_PICO.RUN 28.11,37.74 25.27,40.57 SW1.A
PLUNGER_ADC  (via drill 0.35, 0.45)
  Top 0.3: IC5.4 14.55,6.05 v14.8,6.3
  Top 0.4: FRDM1.A0 50.47,2.88 45.5,7.85 v44.35,7.85 36.35,7.85 35.05,9.15 v26.85,9.15 | RASPBERRY_PI_PICO.GP28_A2 17.95,30.5 20.45,28 v45.3,28 | v60.55,14.9 60.55,15.05 v56.6,19
  Bottom 0.4: v14.8,6.3 24,6.3 v26.85,9.15 | v56.6,19 54.95,20.65 52.65,20.65 v45.3,28 | v44.35,7.85 44.4,7.85 44.8,8.25 54.4,8.25 60.55,14.4 v60.55,14.9
PLUNGER_CAL_BTN  (via drill 0.45)
  Top 0.4: FRDM1.PTE29 61.91,3.9 65.15,3.9 66.65,2.4 v75.1,2.4 | v78.7,31.35 77.85,30.5 76.41,30.5 IC6.15
  Bottom 0.4: v78.7,31.35 78.7,7.25 78.7,6 v75.1,2.4
PLUNGER_CAL_LED  (via drill 0.45)
  Top 0.4: FRDM1.PTE23 58.09,6.14 58.95,7 63.85,7 67.75,3.1 v74.2,3.1 | IC6.14 77.68,29.88 v77.95,29.6
  Bottom 0.4: v77.95,29.6 77.95,6.25 74.8,3.1 v74.2,3.1
PLUNGER_IRQ1_SCL  (via drill 0.45)
  Top 0.4: FRDM1.PTE21 48.6,9.6 40.3,9.6 38.27,11.63 RASPBERRY_PI_PICO.GP11 38.27,20.23 v38.25,20.25 | FRDM1.D10 36.75,50.9 37.75,49.9 37.75,43.3 41.95,39.1 50.7,39.1 53,36.8 53,33.75 51.45,32.2 41.55,32.2 v39.45,30.1
  Bottom 0.4: v38.25,20.25 38.25,28.9 v39.45,30.1
PLUNGER_IRQ2  (via drill 0.45)
  Top 0.4: FRDM1.PTE22 55.55,5.2 50.4,10.35 45.85,10.35 43.35,12.85 RASPBERRY_PI_PICO.GP13 43.33,17.05 43.33,20.18 v43.35,20.2 | v44.73,28.68 47.05,31 52.65,31 53.85,32.2 53.85,36.94 50.94,39.85 43.65,39.85 40.34,43.16 40.34,49.6 FRDM1.D9
  Bottom 0.4: v43.35,20.2 43.35,27.3 v44.73,28.68
PLUNGER_SDA
  Top 0.4: FRDM1.PTE20 46.8,8.85 37.9,8.85 35.73,11.02 RASPBERRY_PI_PICO.GP10
PSU2_STATUS_SENSE
  Top 0.4: FRDM1.D11 34.7,50.9 35.25,50.35 35.25,43.55 38.27,40.53 RASPBERRY_PI_PICO.GP20
PSU2_STATUS_SET
  Top 0.4: FRDM1.D14 22.55,49.61 22.55,47.4 25.9,44.05 29.45,44.05 35.73,37.77 RASPBERRY_PI_PICO.GP21
PWM_BLANK  (via drill 0.45)
  Top 0.4: FRDM1.PTC7 63.17,45.78 64.1,44.85 64.1,41.05 66.9,38.25 67.95,38.25 v68.95,37.25
  Bottom 0.4: RASPBERRY_PI_PICO.GP18 43.35,34.75 46.3,31.8 65,31.8 68.95,35.75 v68.95,37.25
PWM_GSCLK  (via drill 0.45)
  Top 0.4: FRDM1.D0 63.5,50.9 65.15,49.25 65.15,41.7 v67.5,39.35
  Bottom 0.4: v67.5,39.35 67.5,36.35 65.96,34.81 RASPBERRY_PI_PICO.GP16
PWM_SCLK
  Top 0.4: FRDM1.PTC5 53.01,47.51 58.71,41.81 58.71,24.77 RASPBERRY_PI_PICO.GP15
PWM_SIN  (via drill 0.45)
  Top 0.4: FRDM1.PTC6 50.47,47.76 57.12,41.11 57.12,39.17 v56.4,38.45
  Bottom 0.4: RASPBERRY_PI_PICO.GP17 48.43,37.78 49.1,38.45 v56.4,38.45
PWM_XLAT  (via drill 0.45)
  Top 0.4: FRDM1.PTC10 47.93,47.12 54.4,40.65 v54.4,40.6
  Bottom 0.4: v54.4,40.6 42.75,40.6 40.81,38.66 RASPBERRY_PI_PICO.GP19
SCL  (via drill 0.35, 0.45)
  Top 0.3: RASPBERRY_PI_PICO.GP5 17.95,17.2 23.07,22.32 v53,22.32 | v75.2,35.1 76.36,35.1 IC6.22 | R7.2 17.97,11.35 17.97,10.35 17.7,10.08 | IC5.10 17.7,10.08 | 17.7,10.08 17.7,10.1 v17,9.4 | IC4.4 6.81,6.04 v6.55,6.3
  Top 0.4: R7.2 17.97,11.45 17.97,17 RASPBERRY_PI_PICO.GP5
  Bottom 0.3: v75.2,35.1 74.5,34.4 74.5,28 71.65,25.15 62.6,25.15 59.77,22.32 v53,22.32 | v6.55,6.3 8.35,8.1 15.7,8.1 v17,9.4
SDA  (via drill 0.35, 0.45)
  Top 0.3: IC4.6 8.28,4.22 8.78,3.72 10.58,3.72 11.55,4.7 11.55,8.03 13.84,10.31 | 13.84,11.41 15.38,12.96 15.38,17 RASPBERRY_PI_PICO.GP4 15.41,18.76 21.52,24.88 v53.02,24.88 | 13.84,11.41 R6.2 | 13.84,10.31 13.84,11.41 | v74.83,35.73 v74.83,35.72 IC6.23 | IC5.9 16.75,7.05 13.84,9.96 13.84,10.31
  Bottom 0.3: v74.83,35.73 74.38,35.73 72.7,34.05 72.7,29.1 70.5,26.9 59.55,26.9 57.52,24.88 v53.02,24.88
TV_RELAY  (via drill 0.45)
  Top 0.4: FRDM1.D12 31.55,50.9 32.7,49.75 32.7,43.3 v33.55,42.45 | IC6.11 67.87,29.88 v60.3,37.45
  Bottom 0.4: v33.55,42.45 38.6,42.45 39.7,41.35 54.7,41.35 55.4,40.65 57.1,40.65 v60.3,37.45

### Text on the board
tNames: REV 20250201 | RESET | RASPBERRY PI PICO | PINSCAPE PICO / KL25Z EXPANSION BOARD ADAPTER